# EAGLE schematic Converter Board (EAGLE 7.2.0)
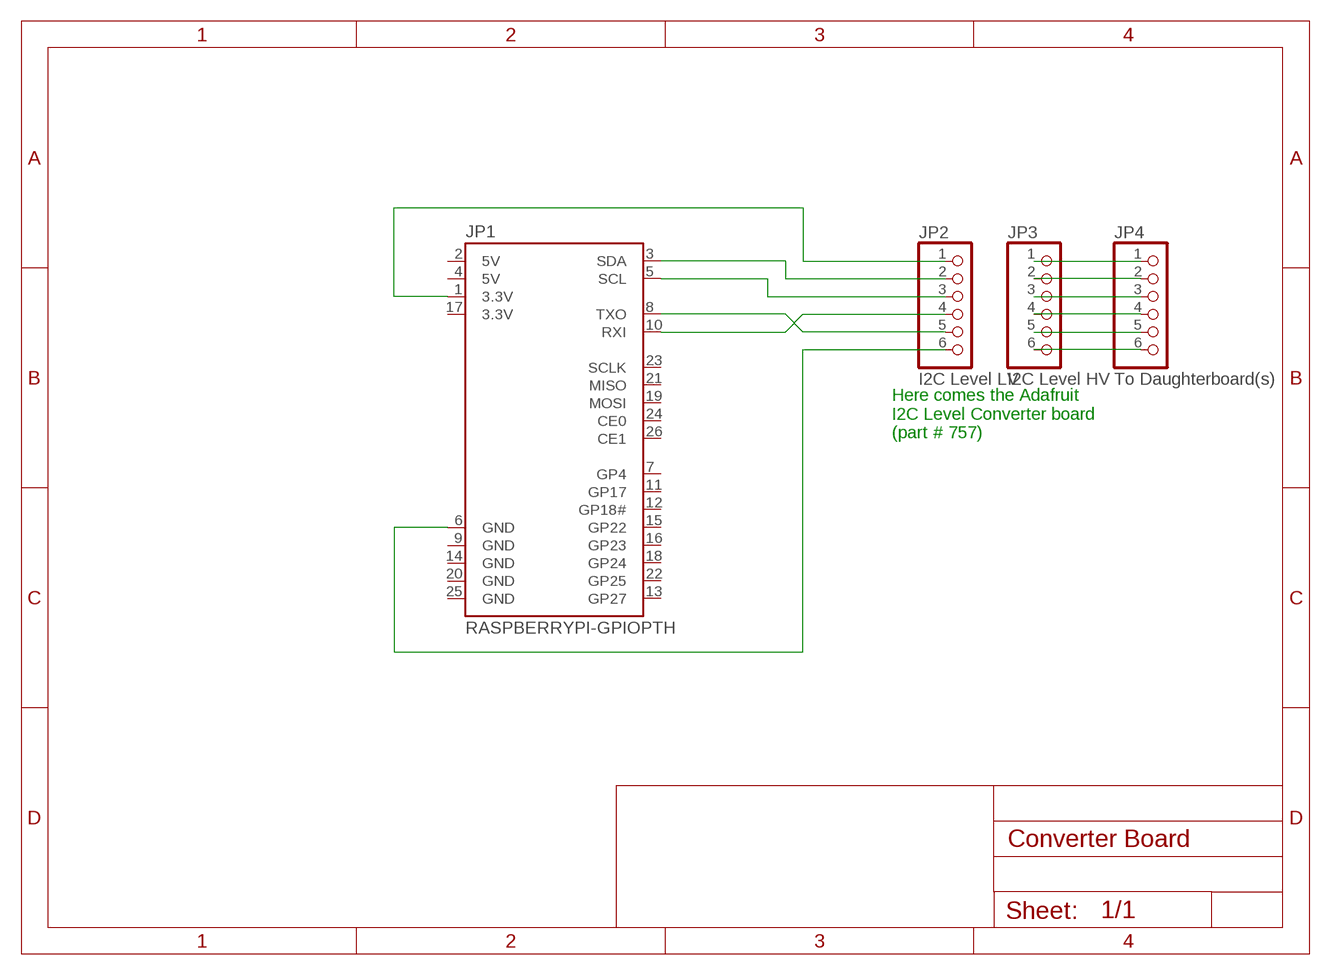
[diagram p0: schematic, sheet 1]

## Parts
JP1  RASPBERRYPI-GPIOPTH  [2X13-SHROUDED]
JP2  I2C Level LV  PINHD-1X6  [1X06]
JP3  I2C Level HV  PINHD-1X6  [1X06]
JP4  To Daughterboard(s)  PINHD-1X6  [1X06]

## Nets
N$1: JP1.3(SDA) JP2.2
N$2: JP1.5(SCL) JP2.3
N$3: JP1.1(3.3V) JP2.1
N$4: JP1.6(GND) JP2.6
N$5: JP3.1 JP4.1
N$6: JP3.2 JP4.2
N$7: JP3.3 JP4.3
N$8: JP3.4 JP4.4
N$9: JP3.5 JP4.5
N$10: JP3.6 JP4.6
N$11: JP1.10(RXI) JP2.4
N$12: JP1.8(TXO) JP2.5
Unconnected: JP1.7(GP4) JP1.11(GP17) JP1.12(GP18#) JP1.13(GP27) JP1.15(GP22) JP1.16(GP23) JP1.18(GP24) JP1.19(MOSI) JP1.21(MISO) JP1.22(GP25) JP1.23(SCLK) JP1.24(CE0) JP1.26(CE1)

## Notes on the sheet
- Here comes the Adafruit
  I2C Level Converter board
  (part # 757)

## Power pins joined to a net without a drawn wire
3.3V: JP1.17(3.3V)
5V: JP1.2(5V) JP1.4(5V)
GND: JP1.9(GND) JP1.14(GND) JP1.20(GND) JP1.25(GND)

## Library data of the parts
JP1 = SparkFun-Boards:RASPBERRYPI-GPIO: RASPBERRY PI I/O HEADER As defined for the Revistion 2 Pi.; DIST: sparkfun; DIST_ID: PRT-11490
JP2-JP4 = pinhead:PINHD-1X6: PIN HEADER